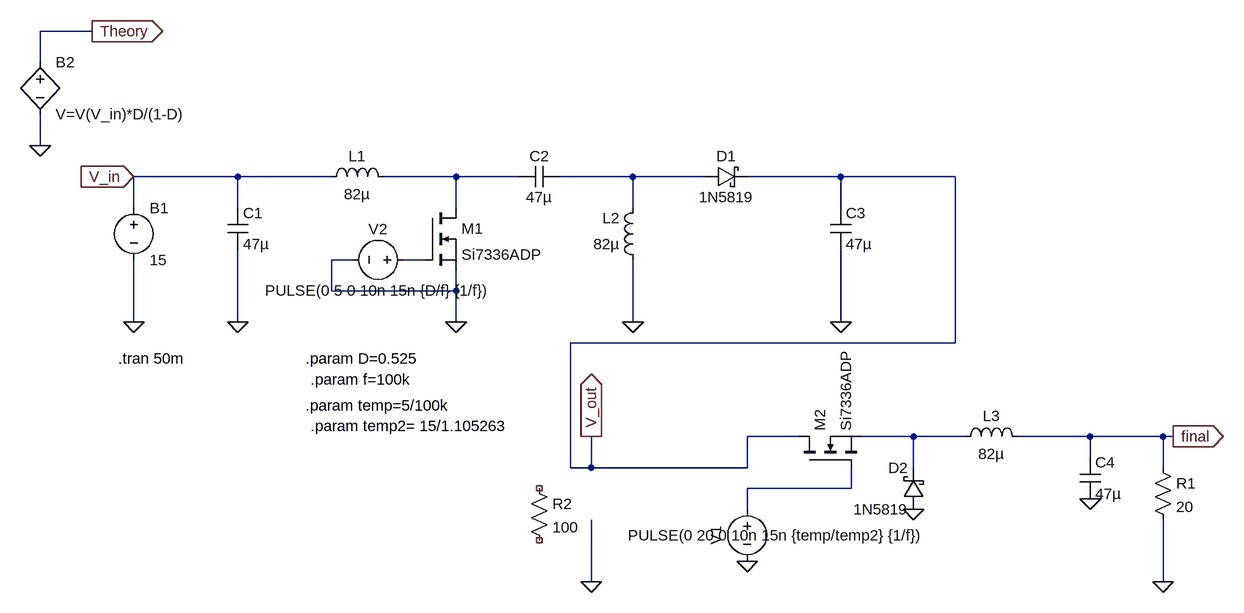
[diagram p0: schematic SEPIC2.asc]
SEPIC2.asc, the LTspice schematic file:
Version 4
SHEET 1 2352 724
WIRE 16 -144 -64 -144
WIRE -64 -96 -64 -144
WIRE -64 32 -64 -16
WIRE 240 80 80 80
WIRE 384 80 240 80
WIRE 576 80 464 80
WIRE 672 80 576 80
WIRE 848 80 736 80
WIRE 960 80 848 80
WIRE 1168 80 1024 80
WIRE 1344 80 1168 80
WIRE 80 128 80 80
WIRE 240 128 240 80
WIRE 576 128 576 80
WIRE 848 128 848 80
WIRE 1168 128 1168 80
WIRE 416 208 384 208
WIRE 528 208 496 208
WIRE 384 256 384 208
WIRE 576 256 576 224
WIRE 576 256 384 256
WIRE 80 304 80 208
WIRE 240 304 240 192
WIRE 576 304 576 256
WIRE 848 304 848 208
WIRE 1168 304 1168 192
WIRE 1344 336 1344 80
WIRE 1344 336 752 336
WIRE 1104 480 1024 480
WIRE 1280 480 1200 480
WIRE 1360 480 1280 480
WIRE 1552 480 1440 480
WIRE 1664 480 1552 480
WIRE 1680 480 1664 480
WIRE 1552 512 1552 480
WIRE 752 528 752 336
WIRE 784 528 784 480
WIRE 784 528 752 528
WIRE 1024 528 1024 480
WIRE 1024 528 784 528
WIRE 1280 528 1280 480
WIRE 1664 528 1664 480
WIRE 1184 560 1184 528
WIRE 1184 560 1024 560
WIRE 1024 592 1024 560
WIRE 784 704 784 608
WIRE 1664 704 1664 608
FLAG 80 80 V_in
IOPIN 80 80 In
FLAG 784 480 V_out
IOPIN 784 480 Out
FLAG 576 304 0
FLAG 848 304 0
FLAG 1168 304 0
FLAG 1664 704 0
FLAG 240 304 0
FLAG 80 304 0
FLAG -64 32 0
FLAG 16 -144 Theory
IOPIN 16 -144 Out
FLAG 1280 592 0
FLAG 1552 576 0
FLAG 1024 672 0
FLAG 1680 480 final
IOPIN 1680 480 Out
FLAG 784 704 0
SYMBOL voltage 80 112 R0
WINDOW 123 0 0 Left 0
WINDOW 39 0 0 Left 0
SYMATTR InstName B1
SYMATTR Value 15
SYMBOL cap 224 128 R0
SYMATTR InstName C1
SYMATTR Value 47µ
SYMBOL ind 368 96 R270
WINDOW 0 32 56 VTop 2
WINDOW 3 5 56 VBottom 2
SYMATTR InstName L1
SYMATTR Value 82µ
SYMBOL ind 864 224 R180
WINDOW 0 36 80 Left 2
WINDOW 3 36 40 Left 2
SYMATTR InstName L2
SYMATTR Value 82µ
SYMBOL nmos 528 128 R0
SYMATTR InstName M1
SYMATTR Value Si7336ADP
SYMBOL cap 736 64 R90
WINDOW 0 0 32 VBottom 2
WINDOW 3 32 32 VTop 2
SYMATTR InstName C2
SYMATTR Value 47µ
SYMBOL schottky 960 96 R270
WINDOW 0 32 32 VTop 2
WINDOW 3 0 32 VBottom 2
SYMATTR InstName D1
SYMATTR Value 1N5819
SYMBOL cap 1152 128 R0
SYMATTR InstName C3
SYMATTR Value 47µ
SYMBOL res 1648 512 R0
SYMATTR InstName R1
SYMATTR Value 20
SYMBOL voltage 512 208 R90
WINDOW 0 -32 56 VBottom 2
WINDOW 3 32 56 VTop 2
WINDOW 123 0 0 Left 0
WINDOW 39 0 0 Left 0
SYMATTR InstName V2
SYMATTR Value PULSE(0 5 0 10n 15n {D/f} {1/f})
SYMBOL bv -64 -112 R0
SYMATTR InstName B2
SYMATTR Value V=V(V_in)*D/(1-D)
SYMBOL nmos 1104 528 R270
SYMATTR InstName M2
SYMATTR Value Si7336ADP
SYMBOL schottky 1296 592 R180
WINDOW 0 24 64 Left 2
WINDOW 3 24 0 Left 2
SYMATTR InstName D2
SYMATTR Value 1N5819
SYMBOL ind 1344 496 R270
WINDOW 0 32 56 VTop 2
WINDOW 3 5 56 VBottom 2
SYMATTR InstName L3
SYMATTR Value 82µ
SYMBOL cap 1536 512 R0
SYMATTR InstName C4
SYMATTR Value 47µ
SYMBOL voltage 1024 576 R0
WINDOW 0 -32 56 VBottom 2
WINDOW 3 46 41 Top 2
WINDOW 123 0 0 Left 0
WINDOW 39 0 0 Left 0
SYMATTR InstName V1
SYMATTR Value PULSE(0 20 0 10n 15n {temp/temp2} {1/f})
SYMBOL res 688 544 R0
SYMATTR InstName R2
SYMATTR Value 100
TEXT 56 360 Left 2 !.tran 50m
TEXT 344 360 Left 2 !.param D=0.525
TEXT 352 392 Left 2 !.param f=100k
TEXT 344 432 Left 2 !.param temp=5/100k
TEXT 352 464 Left 2 !.param temp2= 15/1.105263

The netlist it stands for:
* SEPIC2.asc
V§B1 V_in 0 15
C1 V_in 0 47µ
L1 V_in N001 82µ
L2 0 N002 82µ
M1 N001 N003 0 0 Si7336ADP
C2 N002 N001 47µ
D1 N002 V_out 1N5819
C3 V_out 0 47µ
R1 final 0 20
V2 N003 0 PULSE(0 5 0 10n 15n {D/f} {1/f})
B2 Theory 0 V=V(V_in)*D/(1-D)
M2 V_out N005 N004 N004 Si7336ADP
D2 0 N004 1N5819
L3 N004 final 82µ
C4 final 0 47µ
V1 N005 0 PULSE(0 20 0 10n 15n {temp/temp2} {1/f})
R2 NC_01 NC_02 100
.model D D
.lib standard.dio
.model NMOS NMOS
.model PMOS PMOS
.lib standard.mos
.tran 50m
.param D=0.525
.param f=100k
.param temp=5/100k
.param temp2= 15/1.105263
.backanno
.end